# EAGLE board RX08-3-5-9 (EAGLE 6.6.0), part 1 of 2
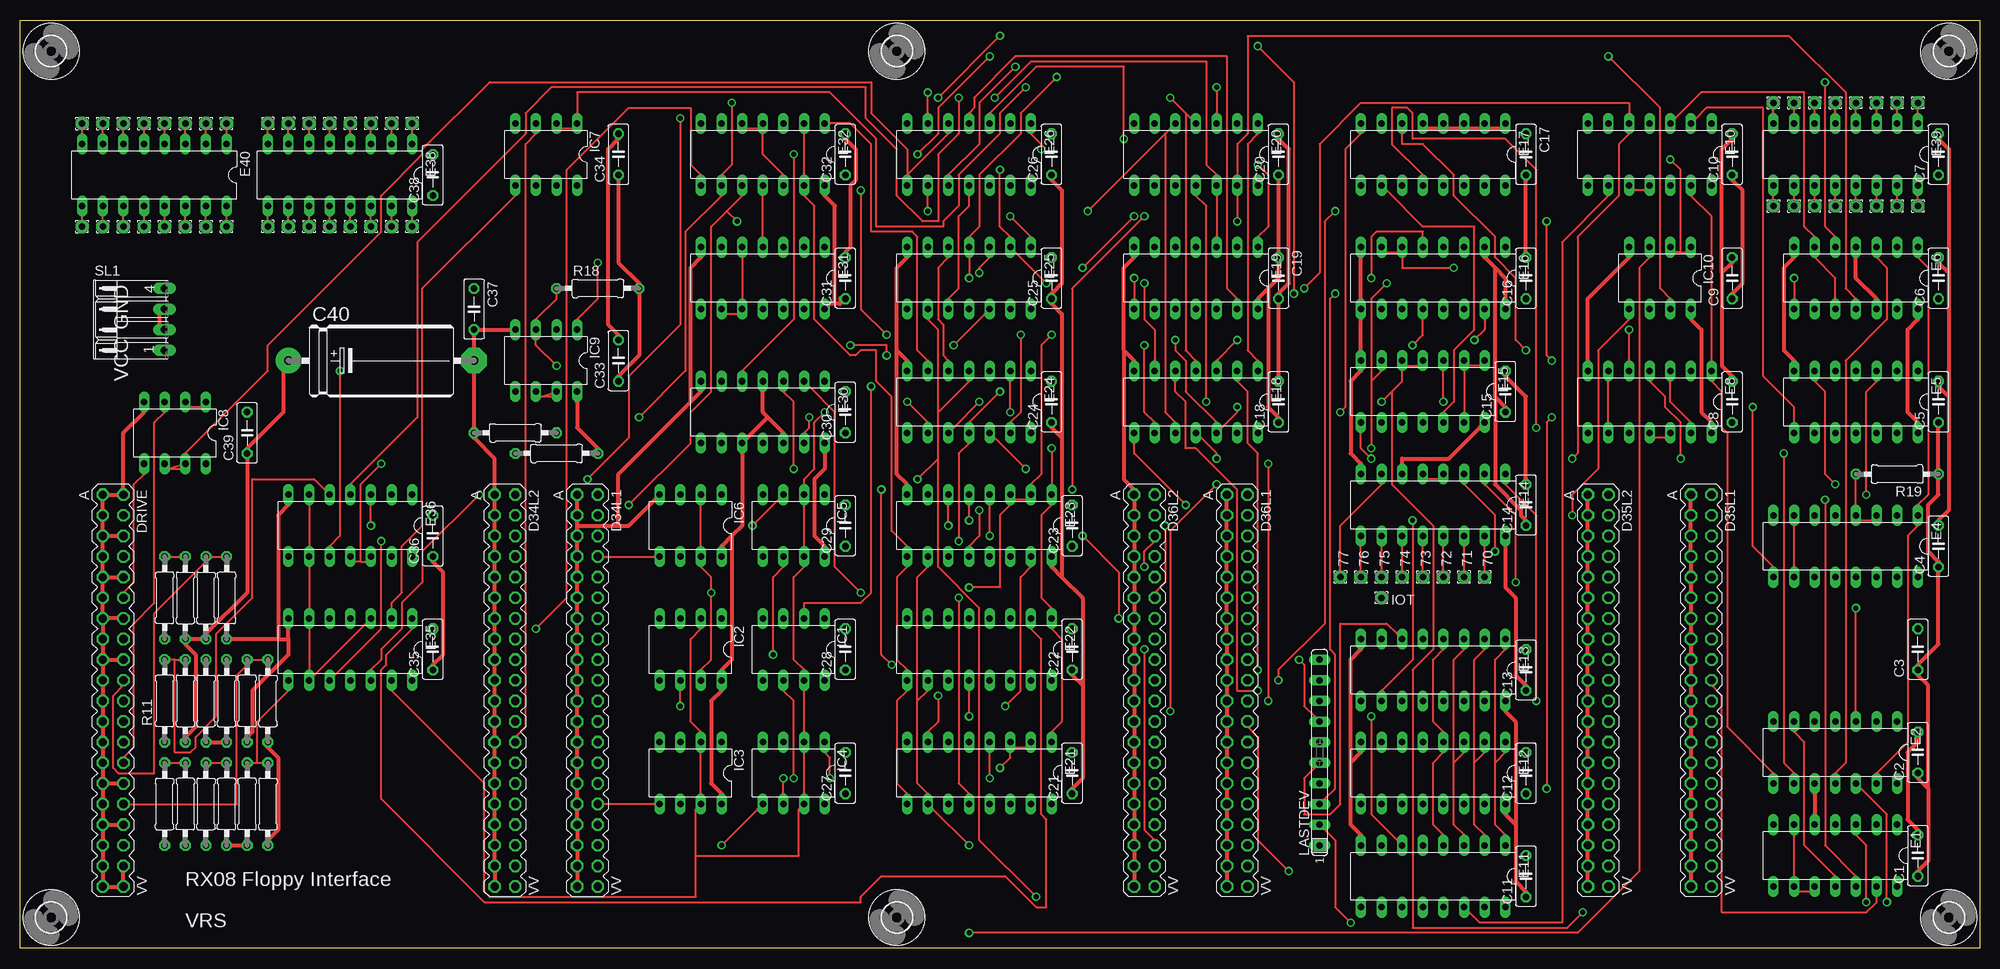
[diagram p3: board, top side]
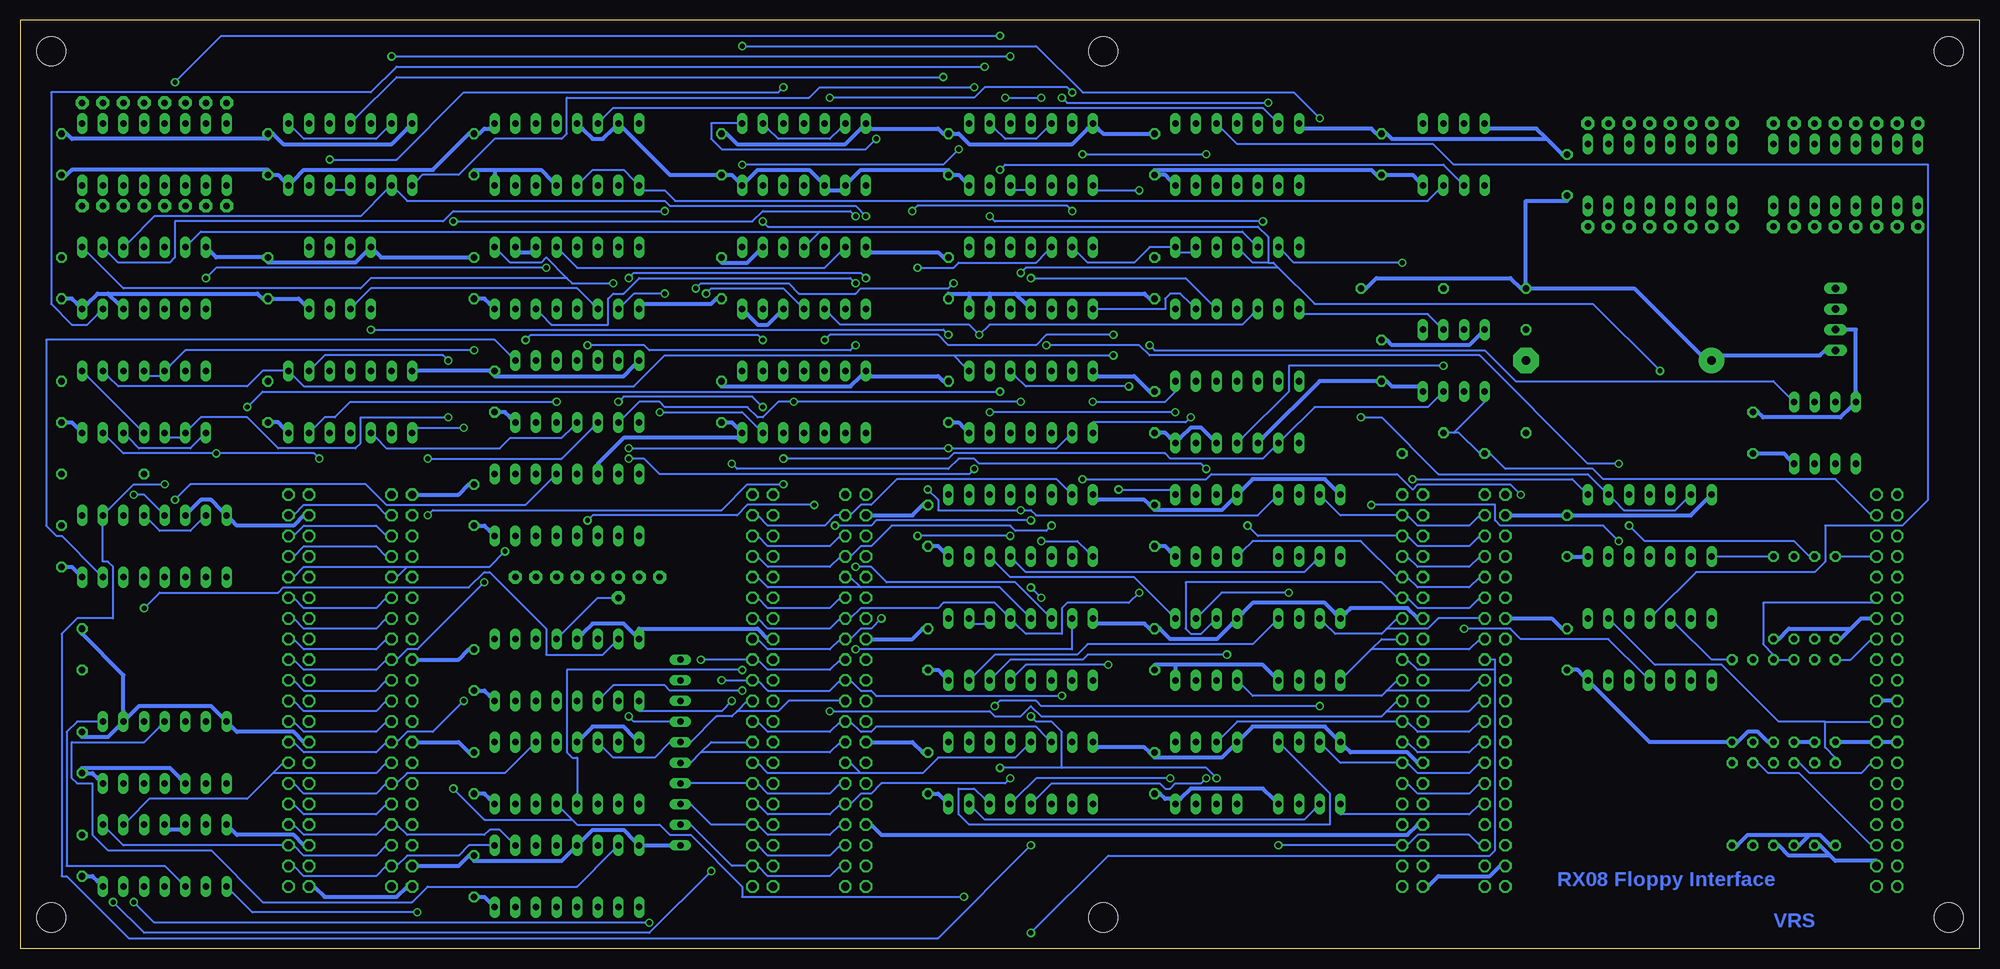
[diagram p4: board, bottom side, seen from below]

Size 241.3 x 114.3 mm. Coordinates in mm from the lower left corner, seen from the top.
Outline: 0,0 0,114.3 241.3,114.3 241.3,0 0,0
Copper layers (1*16): Top 0.035mm / dielectric 1.5mm / Bottom 0.035mm
Design rules "olimex10mil": minimum track width 10mil, minimum drill 24mil, track to track 10mil, track to pad 10mil, pad to pad 10mil, via to via 10mil, smd to smd 10mil, copper to edge 25mil, drill to drill 10mil, minimum pad ring 10mil, minimum via ring 8mil, stop-mask expansion 0mil, vias tented up to drill 0mil, thermal gap 10mil
Net classes: 1 supply: width 0.508 mm

## Footprints (pad centres in the part's own frame; a part is rotated, then mirrored left to right if it is on the bottom)
1,6/0,8 = drill 0.813 pad 1.6 octagon: 1 0,0
C050-025X075 = drill 0.813 octagon: 1 -2.54,0; 2 2.54,0
E22-9 = drill 1.016 pad 3.15: + -11.43,0 | drill 1.016 pad 3.15 octagon: - 11.43,0
DEC40PINV = drill 1.016 octagon: A -24.13,-1.27; AA 3.81,-1.27; B -24.13,1.27; BB 3.81,1.27; C -21.59,-1.27; CC 6.35,-1.27; D -21.59,1.27; DD 6.35,1.27; E -19.05,-1.27; EE 8.89,-1.27; F -19.05,1.27; FF 8.89,1.27; H -16.51,-1.27; HH 11.43,-1.27; J -16.51,1.27; JJ 11.43,1.27; K -13.97,-1.27; KK 13.97,-1.27; L -13.97,1.27; LL 13.97,1.27; M -11.43,-1.27; MM 16.51,-1.27; N -11.43,1.27; NN 16.51,1.27; P -8.89,-1.27; PP 19.05,-1.27; R -8.89,1.27; RR 19.05,1.27; S -6.35,-1.27; SS 21.59,-1.27; T -6.35,1.27; TT 21.59,1.27; U -3.81,-1.27; UU 24.13,-1.27; V -3.81,1.27; VV 24.13,1.27; W -1.27,-1.27; X -1.27,1.27; Y 1.27,-1.27; Z 1.27,1.27
DIL14 = drill 0.813 long: 1 -7.62,-3.81; 2 -5.08,-3.81; 3 -2.54,-3.81; 4 0,-3.81; 5 2.54,-3.81; 6 5.08,-3.81; 7 7.62,-3.81; 8 7.62,3.81; 9 5.08,3.81; 10 2.54,3.81; 11 0,3.81; 12 -2.54,3.81; 13 -5.08,3.81; 14 -7.62,3.81
DIL16 = drill 0.813 long: 1 -8.89,-3.81; 2 -6.35,-3.81; 3 -3.81,-3.81; 4 -1.27,-3.81; 5 1.27,-3.81; 6 3.81,-3.81; 7 6.35,-3.81; 8 8.89,-3.81; 9 8.89,3.81; 10 6.35,3.81; 11 3.81,3.81; 12 1.27,3.81; 13 -1.27,3.81; 14 -3.81,3.81; 15 -6.35,3.81; 16 -8.89,3.81
DIL08 = drill 0.813 long: 1 -3.81,-3.81; 2 -1.27,-3.81; 3 1.27,-3.81; 4 3.81,-3.81; 5 3.81,3.81; 6 1.27,3.81; 7 -1.27,3.81; 8 -3.81,3.81
SIL10 = drill 0.813 long: 1 -11.43,0; 2 -8.89,0; 3 -6.35,0; 4 -3.81,0; 5 -1.27,0; 6 1.27,0; 7 3.81,0; 8 6.35,0; 9 8.89,0; 10 11.43,0
0207/10 = drill 0.813 octagon: 1 -5.08,0; 2 5.08,0
04PA = drill 0.914 long: 1 -3.81,0; 2 -1.27,0; 3 1.27,0; 4 3.81,0
3,6 = hole 3.6: 0,0

## Placement (x,y rotation side)
70  [1,6/0,8]  180.34,45.72 270 top
71  [1,6/0,8]  177.8,45.72 270 top
72  [1,6/0,8]  175.26,45.72 270 top
73  [1,6/0,8]  172.72,45.72 270 top
74  [1,6/0,8]  170.18,45.72 270 top
75  [1,6/0,8]  167.64,45.72 270 top
76  [1,6/0,8]  165.1,45.72 270 top
77  [1,6/0,8]  162.56,45.72 270 top
C1  0.1  [C050-025X075]  233.68,11.43 90 top
C2  0.1  [C050-025X075]  233.68,24.13 90 top
C3  0.1  [C050-025X075]  233.68,36.83 90 top
C4  0.1  [C050-025X075]  236.22,49.53 90 top
C5  0.1  [C050-025X075]  236.22,67.31 90 top
C6  0.1  [C050-025X075]  236.22,82.55 90 top
C7  0.1  [C050-025X075]  236.22,97.79 90 top
C8  0.1  [C050-025X075]  210.82,67.31 90 top
C9  0.1  [C050-025X075]  210.82,82.55 90 top
C10  0.1  [C050-025X075]  210.82,97.79 90 top
C11  0.1  [C050-025X075]  185.42,8.89 90 top
C12  0.1  [C050-025X075]  185.42,21.59 90 top
C13  0.1  [C050-025X075]  185.42,34.29 90 top
C14  0.1  [C050-025X075]  185.42,54.61 90 top
C15  0.1  [C050-025X075]  182.88,68.58 90 top
C16  0.1  [C050-025X075]  185.42,82.55 90 top
C17  0.1  [C050-025X075]  185.42,97.79 270 top
C18  0.1  [C050-025X075]  154.94,67.31 90 top
C19  0.1  [C050-025X075]  154.94,82.55 270 top
C20  0.1  [C050-025X075]  154.94,97.79 90 top
C21  0.1  [C050-025X075]  129.54,21.59 90 top
C22  0.1  [C050-025X075]  129.54,36.83 90 top
C23  0.1  [C050-025X075]  129.54,52.07 90 top
C24  0.1  [C050-025X075]  127,67.31 90 top
C25  0.1  [C050-025X075]  127,82.55 90 top
C26  0.1  [C050-025X075]  127,97.79 90 top
C27  0.1  [C050-025X075]  101.6,21.59 90 top
C28  0.1  [C050-025X075]  101.6,36.83 90 top
C29  0.1  [C050-025X075]  101.6,52.07 90 top
C30  0.1  [C050-025X075]  101.6,66.04 90 top
C31  0.1  [C050-025X075]  101.6,82.55 90 top
C32  0.1  [C050-025X075]  101.6,97.79 90 top
C33  0.1  [C050-025X075]  73.66,72.39 90 top
C34  0.1  [C050-025X075]  73.66,97.79 90 top
C35  0.1  [C050-025X075]  50.8,36.83 90 top
C36  0.1  [C050-025X075]  50.8,50.8 90 top
C37  0.1  [C050-025X075]  55.88,78.74 270 top
C38  0.1  [C050-025X075]  50.8,95.25 90 top
C39  0.1  [C050-025X075]  27.94,63.5 90 top
C40  100uf  [E22-9]  44.45,72.39 0 top
D34L1  [DEC40PINV]  69.85,31.75 270 top
D34L2  [DEC40PINV]  59.69,31.75 270 top
D35L1  [DEC40PINV]  207.01,31.75 270 top
D35L2  [DEC40PINV]  194.31,31.75 270 top
D36L1  [DEC40PINV]  149.86,31.75 270 top
D36L2  [DEC40PINV]  138.43,31.75 270 top
DRIVE  [DEC40PINV]  11.43,31.75 270 top
E1  74LS10N  [DIL14]  223.52,11.43 180 top
E2  74LS74N  [DIL14]  223.52,24.13 180 top
E4  74LS161N  [DIL16]  224.79,49.53 180 top
E5  74LS00N  [DIL14]  226.06,67.31 180 top
E6  74LS74N  [DIL14]  226.06,82.55 180 top
E8  74LS10N  [DIL14]  200.66,67.31 180 top
E10  74LS10N  [DIL14]  200.66,97.79 180 top
E11  74LS138N  [DIL16]  173.99,8.89 180 top
E12  74LS138N  [DIL16]  173.99,21.59 180 top
E13  74LS138N  [DIL16]  173.99,34.29 180 top
E14  74LS138N  [DIL16]  173.99,54.61 180 top
E15  74LS00N  [DIL14]  172.72,68.58 180 top
E16  74LS195N  [DIL16]  173.99,82.55 180 top
E17  7476N  [DIL16]  173.99,97.79 180 top
E18  74LS02N  [DIL14]  144.78,67.31 180 top
E19  74LS74N  [DIL14]  144.78,82.55 180 top
E20  74LS32N  [DIL14]  144.78,97.79 180 top
E21  74LS195N  [DIL16]  118.11,21.59 180 top
E22  74LS195N  [DIL16]  118.11,36.83 180 top
E23  74LS195N  [DIL16]  118.11,52.07 180 top
E24  74LS08N  [DIL14]  116.84,67.31 180 top
E25  74LS04N  [DIL14]  116.84,82.55 180 top
E26  74LS02N  [DIL14]  116.84,97.79 180 top
E30  74LS74N  [DIL14]  91.44,66.04 180 top
E31  74LS20N  [DIL14]  91.44,82.55 180 top
E32  74LS27N  [DIL14]  91.44,97.79 180 top
E35  74LS02N  [DIL14]  40.64,36.83 180 top
E36  74LS02N  [DIL14]  40.64,52.07 180 top
E38  SPARE  [DIL16]  39.37,95.25 180 top
E39  SPARE  [DIL16]  224.79,97.79 180 top
E40  SPARE  [DIL16]  16.51,95.25 180 top
IC1  DS75452N  [DIL08]  95.25,36.83 180 top
IC2  DS75452N  [DIL08]  82.55,36.83 180 top
IC3  DS75452N  [DIL08]  82.55,21.59 180 top
IC4  DS75452N  [DIL08]  95.25,21.59 180 top
IC5  DS75452N  [DIL08]  95.25,52.07 180 top
IC6  DS75452N  [DIL08]  82.55,52.07 180 top
IC7  DS75452N  [DIL08]  64.77,97.79 180 top
IC8  DS75452N  [DIL08]  19.05,63.5 180 top
IC9  DS75452N  [DIL08]  64.77,72.39 180 top
IC10  DS75452N  [DIL08]  201.93,82.55 180 top
IOT  [1,6/0,8]  167.64,43.18 270 top
LASTDEV  100  [SIL10]  160.02,24.13 90 top
PAD10  [1,6/0,8]  48.26,101.6 0 top
PAD11  [1,6/0,8]  45.72,101.6 0 top
PAD12  [1,6/0,8]  43.18,101.6 0 top
PAD13  [1,6/0,8]  40.64,101.6 0 top
PAD14  [1,6/0,8]  38.1,101.6 0 top
PAD15  [1,6/0,8]  35.56,101.6 0 top
PAD16  [1,6/0,8]  33.02,101.6 0 top
PAD17  [1,6/0,8]  30.48,101.6 0 top
PAD18  [1,6/0,8]  25.4,101.6 180 top
PAD19  [1,6/0,8]  22.86,101.6 180 top
PAD20  [1,6/0,8]  48.26,88.9 0 top
PAD21  [1,6/0,8]  45.72,88.9 0 top
PAD22  [1,6/0,8]  43.18,88.9 0 top
PAD23  [1,6/0,8]  40.64,88.9 0 top
PAD24  [1,6/0,8]  38.1,88.9 0 top
PAD25  [1,6/0,8]  35.56,88.9 0 top
PAD26  [1,6/0,8]  33.02,88.9 0 top
PAD27  [1,6/0,8]  30.48,88.9 0 top
PAD28  [1,6/0,8]  20.32,101.6 180 top
PAD29  [1,6/0,8]  17.78,101.6 180 top
PAD30  [1,6/0,8]  15.24,101.6 180 top
PAD31  [1,6/0,8]  12.7,101.6 180 top
PAD32  [1,6/0,8]  10.16,101.6 180 top
PAD33  [1,6/0,8]  7.62,101.6 180 top
PAD34  [1,6/0,8]  25.4,88.9 180 top
PAD35  [1,6/0,8]  22.86,88.9 180 top
PAD36  [1,6/0,8]  20.32,88.9 180 top
PAD37  [1,6/0,8]  17.78,88.9 180 top
PAD38  [1,6/0,8]  15.24,88.9 180 top
PAD39  [1,6/0,8]  12.7,88.9 180 top
PAD40  [1,6/0,8]  10.16,88.9 180 top
PAD41  [1,6/0,8]  7.62,88.9 180 top
PAD42  [1,6/0,8]  233.68,104.14 180 top
PAD43  [1,6/0,8]  231.14,104.14 180 top
PAD44  [1,6/0,8]  228.6,104.14 180 top
PAD45  [1,6/0,8]  226.06,104.14 180 top
PAD46  [1,6/0,8]  223.52,104.14 180 top
PAD47  [1,6/0,8]  220.98,104.14 180 top
PAD48  [1,6/0,8]  218.44,104.14 180 top
PAD49  [1,6/0,8]  215.9,104.14 180 top
PAD50  [1,6/0,8]  233.68,91.44 180 top
PAD51  [1,6/0,8]  231.14,91.44 180 top
PAD52  [1,6/0,8]  228.6,91.44 180 top
PAD53  [1,6/0,8]  226.06,91.44 180 top
PAD54  [1,6/0,8]  223.52,91.44 180 top
PAD55  [1,6/0,8]  220.98,91.44 180 top
PAD56  [1,6/0,8]  218.44,91.44 180 top
PAD57  [1,6/0,8]  215.9,91.44 180 top
R1  180  [0207/10]  20.32,30.48 270 top
R2  180  [0207/10]  30.48,30.48 270 top
R3  180  [0207/10]  30.48,17.78 270 top
R4  180  [0207/10]  22.86,43.18 270 top
R5  180  [0207/10]  20.32,43.18 270 top
R6  180  [0207/10]  66.04,60.96 0 top
R7  180  [0207/10]  22.86,17.78 270 top
R8  180  [0207/10]  17.78,17.78 270 top
R9  390  [0207/10]  22.86,30.48 270 top
R10  390  [0207/10]  27.94,30.48 90 top
R11  390  [0207/10]  17.78,30.48 90 top
R12  390  [0207/10]  27.94,17.78 90 top
R13  390  [0207/10]  25.4,43.18 90 top
R14  390  [0207/10]  17.78,43.18 90 top
R15  390  [0207/10]  60.96,63.5 0 top
R16  390  [0207/10]  25.4,17.78 90 top
R17  390  [0207/10]  20.32,17.78 90 top
R18  10K  [0207/10]  71.12,81.28 0 top
R19  10K  [0207/10]  231.14,58.42 180 top
R20  180  [0207/10]  25.4,30.48 270 top
SL1  [04PA]  17.78,77.47 90 top
U$1  [3,6]  237.49,3.81 0 top
U$2  [3,6]  237.49,110.49 0 top
U$3  [3,6]  3.81,110.49 0 top
U$4  [3,6]  3.81,3.81 0 top
U$5  [3,6]  107.95,110.49 0 top
U$6  [3,6]  107.95,3.81 0 top

## Tracks (layer width: path | path; a pad name or v marks a point on that pad's centre or on a via)
8/12  (via drill 0.61)
  Top 0.254: v204.47,60.33 204.47,64.77 202.56,66.67 202.56,67.94 200.66,69.85 E8.4 | v217.17,60.96 217.17,22.86 218.44,21.59 E2.9
  Bottom 0.254: v204.47,60.33 205.1,60.96 v217.17,60.96 228.6,60.96 230.5,62.87 E5.13
8/!12  (via drill 0.61)
  Top 0.254: IC8.2 20.95,66.67 22.23,66.67 IC8.1 | E2.8 215.9,21.59 210.19,27.3 210.19,63.5 209.55,64.14 209.55,68.58 208.28,69.85 E8.1 208.28,72.39 208.28,90.17 205.74,92.71 E10.13 | v102.23,74.3 106.68,74.3 v106.68,73.03
  Bottom 0.254: 126.36,73.03 125.09,71.75 E24.1 | 126.36,73.03 161.93,73.03 165.74,69.22 206.38,69.22 207.65,70.48 E8.1 208.91,71.12 211.46,71.12 213.36,69.22 229.24,69.22 230.5,70.48 E5.2 | v102.23,74.3 101.6,73.66 60.96,73.66 57.15,69.85 25.4,69.85 23.5,67.94 IC8.1 | 126.36,73.03 v106.68,73.03
!ACB00
  Bottom 0.254: IC6.3 80.64,55.24 78.74,53.34 71.75,53.34 D34L1.D 70.48,53.34 69.22,52.07 62.87,52.07 61.59,53.34 D34L2.D
!ACB01
  Top 0.254: IC6.5 78.11,48.26 71.75,48.26 D34L1.J
  Bottom 0.254: D34L2.J 61.59,48.26 62.87,46.99 69.22,46.99 70.48,48.26 D34L1.J
!ACB02
  Bottom 0.254: IC1.3 94.61,40.01 95.89,38.73 97.16,38.73 97.79,39.37 97.79,45.09 73.66,45.09 71.75,43.18 D34L1.N 70.48,43.18 69.22,41.91 62.87,41.91 61.59,43.18 D34L2.N
!ACB03
  Bottom 0.254: 74.93,36.83 73.66,38.1 71.75,38.1 D34L1.T | 74.93,36.83 78.11,33.66 IC2.5 | 74.93,36.83 62.87,36.83 61.59,38.1 D34L2.T
!ACB04
  Bottom 0.254: 73.03,31.75 71.75,33.02 D34L1.X | 73.03,31.75 73.66,31.11 89.53,31.11 90.81,32.38 IC1.5 | 73.03,31.75 62.87,31.75 61.59,33.02 D34L2.X
!ACB05
  Bottom 0.254: IC4.3 93.34,26.04 91.44,27.94 71.75,27.94 D34L1.BB 70.48,27.94 69.22,26.67 62.87,26.67 61.59,27.94 D34L2.BB
!ACB06
  Bottom 0.254: IC3.3 80.64,24.77 78.74,22.86 71.75,22.86 D34L1.FF 70.48,22.86 69.22,21.59 62.87,21.59 61.59,22.86 D34L2.FF
!ACB07
  Top 0.254: IC3.5 78.11,17.78 71.75,17.78 D34L1.LL
  Bottom 0.254: D34L2.LL 61.59,17.78 62.87,16.51 78.74,16.51 IC3.5
!ACB08  (via drill 0.61)
  Top 0.254: v86.36,12.7 90.81,17.14 IC4.5
  Bottom 0.254: v86.36,12.7 71.75,12.7 D34L1.RR 70.48,12.7 69.22,13.97 62.87,13.97 61.59,12.7 D34L2.RR
!ACB09  (via drill 0.61)
  Top 0.254: v90.17,52.07 93.34,55.24 IC5.3
  Bottom 0.254: v90.17,52.07 88.9,50.8 71.75,50.8 D34L1.F 70.48,50.8 69.22,49.53 62.87,49.53 61.59,50.8 D34L2.F
!ACB10
  Bottom 0.254: IC5.5 90.81,48.9 89.53,50.16 76.2,50.16 71.75,45.72 D34L1.L 70.48,45.72 69.22,44.45 62.87,44.45 61.59,45.72 D34L2.L
!ACB11
  Bottom 0.254: 73.03,39.37 71.75,40.64 D34L1.R | 73.03,39.37 73.66,38.73 79.38,38.73 80.64,40.01 IC2.3 | 73.03,39.37 67.94,39.37 66.67,40.64 61.59,40.64 D34L2.R
!ACCLEAR
  Top 0.254: IC7.3 63.5,100.33 62.23,99.06 62.23,27.3 60.96,26.04 D34L2.DD
  Bottom 0.254: D34L1.DD 70.48,25.4 69.22,24.13 62.87,24.13 61.59,25.4 D34L2.DD
!BMB03
  Bottom 0.254: D35L2.T 196.22,38.1 197.49,36.83 206.38,36.83 207.65,38.1 D35L1.T
!BMB04
  Bottom 0.254: D35L2.BB 196.22,27.94 197.49,26.67 206.38,26.67 207.65,27.94 D35L1.BB
!BMB05
  Bottom 0.254: D35L2.LL 196.22,17.78 197.49,16.51 206.38,16.51 207.65,17.78 D35L1.LL
!BMB06
  Bottom 0.254: D35L2.F 196.22,50.8 197.49,52.07 206.38,52.07 207.65,50.8 D35L1.F
!BMB07
  Bottom 0.254: D35L2.R 196.22,40.64 197.49,39.37 206.38,39.37 207.65,40.64 D35L1.R
!BMB08
  Bottom 0.254: D35L2.Z 196.22,30.48 197.49,29.21 206.38,29.21 207.65,30.48 D35L1.Z
!BRUN
  Bottom 0.254: D34L2.JJ 61.59,20.32 62.87,19.05 69.22,19.05 70.48,20.32 D34L1.JJ
!CLK_PARITY  (via drill 0.61)
  Top 0.254: v185.42,73.66 184.15,74.93 184.15,82.55 181.61,85.09 181.61,87.63 176.53,92.71 176.53,95.25 172.72,99.06 170.18,99.06 170.18,100.33 E17.6
  Bottom 0.254: E5.4 225.43,70.48 224.16,70.48 E5.5 222.88,71.75 220.98,73.66 v185.42,73.66 | E32.6 87,102.23 88.27,103.5 168.28,103.5 169.54,102.23 E17.6
!DONE  (via drill 0.61)
  Top 0.254: v116.84,82.55 116.84,85.09 E25.4 116.84,87.63 118.11,88.9 118.11,95.25 123.19,100.33 123.19,102.87 v127.64,107.31
  Bottom 0.254: v116.84,82.55 97.79,82.55 94.61,79.38 E31.12 | v127.64,107.31 194.94,107.31 200.03,102.23 E10.4
!DONE_FF  (via drill 0.61)
  Top 0.254: v138.43,74.3 138.43,66.04 139.7,64.77 E18.9 | v171.45,74.3 172.72,75.56 172.72,77.47 E16.12
  Bottom 0.254: v138.43,74.3 139.06,73.66 163.83,73.66 164.47,74.3 v171.45,74.3
!ENB_BUF_LD  (via drill 0.61)
  Top 0.254: E32.2 96.52,100.33 96.52,95.25 E32.13 96.52,92.71 97.79,91.44 97.79,77.47 102.23,73.03 102.87,73.03 103.5,73.66 105.41,73.66 105.41,69.85 107.31,67.94 107.31,51.44 109.22,49.53 E23.9 109.22,46.99 107.95,45.72 107.95,35.56 109.22,34.29 E22.9 109.22,31.75 107.95,30.48 107.95,20.32 109.22,19.05 E21.9 | v213.36,66.67 213.36,49.53 215.9,46.99 E4.9 | v120.65,68.58 116.84,64.77 E24.11 116.84,62.23 115.57,60.96 v115.57,50.16
  Bottom 0.254: v213.36,66.67 211.46,68.58 v120.65,68.58 | v115.57,50.16 111.12,50.16 109.86,48.9 E23.9
!ERR_FF  (via drill 0.61)
  Top 0.254: v138.43,81.92 138.43,77.47 139.7,76.2 139.7,72.39 E18.6
  Bottom 0.254: v138.43,81.92 139.06,82.55 165.1,82.55 167,80.64 168.28,80.64 168.91,80.01 168.91,76.83 175.9,76.83 177.16,78.11 E16.14
!INIT  (via drill 0.61)
  Top 0.254: E2.13 228.6,21.59 232.41,25.4 232.41,50.8 233.68,52.07 E4.1 233.68,54.61 234.95,55.88 234.95,83.82 233.68,85.09 E6.1 | E21.1 127,26.67 128.27,27.94 128.27,38.1 127,39.37 E22.1 127,41.91 125.73,43.18 125.73,53.34 127,54.61 E23.1 127,57.15 v127,61.59 | v109.22,67.31 111.76,64.77 E24.9 | 166.37,69.85 167.64,71.12 E15.6 | 166.37,69.85 v166.37,61.59 | v168.28,81.92 166.37,80.01 166.37,69.85
  Bottom 0.254: E24.9 112.39,62.87 113.67,61.59 v127,61.59 v166.37,61.59 | v109.22,67.31 100.33,67.31 99.06,68.58 E30.1 | 173.99,82.55 173.35,81.92 v168.28,81.92 | 173.99,82.55 176.53,85.09 177.16,84.45 180.97,84.45 182.25,85.72 E16.1 | 173.99,82.55 198.12,82.55 199.39,81.28 228.6,81.28 233.04,85.72 E6.1
!INIT1
  Bottom 0.254: E11.7 168.28,12.06 172.72,7.62 191.13,7.62 193.04,5.71 211.46,5.71 217.81,12.06 230.5,12.06 232.41,13.97 232.41,20.32 234.31,20.32 234.95,20.95 234.95,25.4 226.06,25.4 224.16,27.3 E2.4
!INIT4  (via drill 0.61)
  Top 0.254: v226.06,41.91 226.06,29.21 E2.3
  Bottom 0.254: v226.06,41.91 224.16,43.81 209.55,43.81 208.91,44.45 186.06,44.45 184.15,46.35 183.51,46.35 176.53,39.37 176.53,36.2 169.54,36.2 168.28,37.47 E13.7
!INT_RQ  (via drill 0.61)
  Top 0.254: v191.13,53.34 191.13,55.88 194.31,59.05 194.31,73.66 198.12,77.47 IC10.5 | v147.32,57.15 141.6,51.44 v141.6,29.21
  Bottom 0.254: v191.13,53.34 190.5,53.98 154.94,53.98 151.76,57.15 v147.32,57.15 | v141.6,29.21 121.92,29.21 121.28,28.57 118.11,28.57 116.84,29.84 115.57,28.57 73.66,28.57 73.03,29.21 | 73.03,29.21 71.75,30.48 D34L1.Z | 73.03,29.21 62.87,29.21 61.59,30.48 D34L2.Z
!INTR4  (via drill 0.61)
  Top 0.254: v95.25,59.05 95.25,67.31 93.98,68.58 E30.3 | v153.67,59.69 v153.67,30.48
  Bottom 0.254: v95.25,59.05 95.89,59.69 123.19,59.69 123.83,60.33 125.73,60.33 127,59.05 153.03,59.05 v153.67,59.69 | v153.67,30.48 154.94,29.21 165.1,29.21 E13.9
!IOS  (via drill 0.61)
  Top 0.254: v116.84,1.91 191.77,1.91 199.39,9.53 199.39,83.82 200.66,85.09 IC10.3
  Bottom 0.254: v116.84,1.91 107.31,11.43 60.33,11.43 59.69,12.06 59.69,34.29 | 59.69,34.29 59.69,35.56 60.33,35.56 D34L2.V | 59.69,34.29 69.22,34.29 70.48,35.56 D34L1.V
!LCD1  (via drill 0.61)
  Top 0.254: E2.11 223.52,21.59 224.79,22.86 224.79,72.39 229.87,77.47 229.87,83.82 228.6,85.09 E6.3 | E24.5 114.3,72.39 113.67,73.03 113.67,76.83 113.03,77.47 113.03,83.82 114.3,85.09 E25.5 | E11.14 178.44,4.45 179.71,3.17 189.87,3.17 189.87,87 195.58,92.71 E10.9 | v137.16,90.17 v130.81,83.82
  Bottom 0.254: v130.81,83.82 126.36,83.82 125.73,84.45 116.2,84.45 114.94,85.72 E25.5 | v137.16,90.17 138.43,91.44 161.29,91.44 161.93,92.08 193.68,92.08 194.94,93.34 E10.9 196.22,93.34 199.39,90.17 224.79,90.17 227.97,87 E6.3
!MAINT  (via drill 0.61)
  Top 0.254: E6.10 223.52,80.01 223.52,82.55 220.98,85.09 E6.6 220.98,87.63 219.71,88.9 219.71,105.41 207.01,105.41 203.84,102.23 E10.3 | v123.19,75.56 123.19,66.04 121.92,64.77 E24.13 | E31.9 87,78.11 88.27,78.11 E31.10 88.9,80.01 88.9,85.09 E31.5
  Bottom 0.254: E19.10 141.6,78.11 140.34,76.83 124.46,76.83 v123.19,75.56 121.92,76.83 90.81,76.83 89.53,78.11 E31.10 | 142.88,88.27 144.15,87 E19.4 | 142.88,88.27 90.81,88.27 89.53,87 E31.5 | 142.88,88.27 219.07,88.27 220.34,87 E6.6
!MYDEV
  Top 0.254: E11.4 175.26,13.97 173.99,15.24 173.99,22.86 175.26,24.13 E12.4 175.26,26.67 173.99,27.94 173.99,35.56 175.26,36.83 E13.4
  Bottom 0.254: E13.4 174.62,38.73 170.18,43.18 168.28,43.18 IOT.1
!PARITY
  Top 0.254: E17.10 168.28,93.34 172.72,88.9 179.07,88.9 179.07,76.2 176.53,73.66 176.53,67.31 175.26,66.04 E15.12
!RX_12_BIT
  Top 0.254: R7.1 23.5,22.86 24.77,22.86 R16.2 | IC8.3 17.78,66.04 16.51,64.77 16.51,42.55 13.97,40.01 13.97,24.77 12.7,23.5 DRIVE.FF
  Bottom 0.254: R7.1 22.23,22.86 20.95,21.59 14.61,21.59 13.34,22.86 DRIVE.FF
!RX_DATA
  Top 0.254: R8.1 18.41,22.86 19.68,22.86 R17.2 | IC7.5 60.96,92.71 49.53,81.28 49.53,52.07 46.99,49.53 46.99,43.81 45.72,42.55 45.72,41.91 E35.2
  Bottom 0.254: 19.05,27.94 13.34,27.94 DRIVE.BB | 19.05,27.94 24.77,27.94 31.75,34.92 40.01,34.92 45.09,40.01 E35.2 | 19.05,27.94 19.05,24.77 17.78,23.5 R8.1
!RX_DONE
  Top 0.254: R13.2 24.77,48.26 23.5,48.26 R4.1 22.86,47.62 16.51,41.27 16.51,21.59 12.06,21.59 11.43,22.23 11.43,31.11 12.7,32.38 DRIVE.X
  Bottom 0.254: E36.8 32.38,48.26 26.04,48.26 R13.2
!RX_ERROR  (via drill 0.61)
  Top 0.254: R14.2 18.41,48.26 19.68,48.26 R5.1 | v43.18,52.07 43.18,54.61 E36.3
  Bottom 0.254: v43.18,52.07 41.27,50.16 22.86,50.16 20.95,48.26 R5.1 | DRIVE.J 13.34,48.26 17.14,48.26 R14.2
!RX_INIT
  Top 0.254: IC8.5 15.24,58.42 13.97,57.15 13.97,45.09 12.7,43.81 DRIVE.N
  Bottom 0.254: R9.1 23.5,35.56 24.77,35.56 R20.1 25.4,36.2 26.67,37.47 26.67,42.55 12.7,42.55 DRIVE.N
!RX_OUT
  Top 0.254: 29.21,22.86 29.84,22.86 R3.1 | 29.21,22.86 28.57,22.86 R12.2 | 29.21,22.86 29.21,27.94 33.02,31.75 E35.8
  Bottom 0.254: DRIVE.RR 13.34,12.7 22.23,21.59 26.04,21.59 27.3,22.86 R12.2
!RX_RUN
  Bottom 0.254: 64.77,63.5 65.41,63.5 R15.2 | 64.77,63.5 64.14,63.5 61.59,60.96 R6.1 60.33,60.96 58.42,59.05 47.62,59.05 46.35,57.78 17.78,57.78 13.34,53.34 DRIVE.D | 64.77,63.5 60.96,67.31 IC9.5
!RX_SHIFT
  Top 0.254: R2.1 29.84,35.56 28.57,35.56 R10.2 27.94,34.92 26.67,33.66 26.67,17.78 13.34,17.78 DRIVE.LL
  Bottom 0.254: E35.5 37.47,40.01 33.02,35.56 31.11,35.56 R2.1
!RX_TR_REQ
  Top 0.254: 19.05,35.56 19.68,35.56 R1.1 | 19.05,35.56 18.41,35.56 R11.2 | 19.05,35.56 19.05,24.13 20.95,24.13 21.59,24.77 21.59,26.04 24.13,28.57 24.13,38.73 28.57,43.18 28.57,57.78 36.2,57.78 37.47,56.52 E36.5
  Bottom 0.254: DRIVE.T 13.34,38.1 15.88,35.56 17.14,35.56 R11.2
!SDN4  (via drill 0.61)
  Top 0.254: v171.45,52.7 171.45,35.56 167.64,31.75 E13.10 | v143.51,54.61 137.16,60.96 137.16,62.23 E18.8
  Bottom 0.254: v171.45,52.7 170.81,53.34 153.03,53.34 151.76,54.61 v143.51,54.61
!SER4  (via drill 0.61)
  Top 0.254: v152.4,31.75 149.86,31.75 149.86,56.52 144.78,61.59 143.51,61.59 143.51,67.31 142.24,68.58 142.24,69.85 E18.5
  Bottom 0.254: v152.4,31.75 161.29,31.75 161.93,32.38 168.28,32.38 169.54,31.11 E13.11
!STR2  (via drill 0.61)
  Top 0.254: v152.4,34.29 152.4,60.96 151.13,62.23 151.13,68.58 149.86,69.85 E18.2
  Bottom 0.254: v152.4,34.29 173.99,34.29 173.99,24.13 173.35,23.5 172.72,23.5 172.72,19.05 E12.12
!TR_FF  (via drill 0.61)
  Top 0.254: v149.86,74.93 147.32,72.39 E18.3 | v179.07,74.93 180.34,76.2 180.34,77.47 E16.15
  Bottom 0.254: v149.86,74.93 150.5,75.56 178.44,75.56 v179.07,74.93
!XDR2  (via drill 0.61)
  Top 0.254: v56.52,55.88 49.53,48.9 49.53,45.09 46.99,42.55 46.99,39.37 44.45,36.83 44.45,35.56 43.18,34.29 E35.12 | 113.03,60.33 v110.49,57.78 | 113.03,60.33 113.03,66.04 | 113.03,66.04 116.84,69.85 E24.4 | v125.09,6.35 118.11,13.34 118.11,41.91 113.03,46.99 113.03,60.33 | 113.03,66.04 113.03,76.2 111.76,77.47 E25.9 | v188.59,65.41 187.96,64.77 v187.96,19.68
  Bottom 0.254: E5.10 222.88,62.87 221.62,62.87 E5.9 220.34,64.14 219.07,65.41 213.36,65.41 209.55,61.59 200.03,61.59 199.39,62.23 199.39,65.41 v188.59,65.41 | v56.52,55.88 57.78,57.15 69.22,57.15 69.85,56.52 71.75,58.42 94.61,58.42 95.25,57.78 v110.49,57.78 | 173.35,15.88 172.72,15.24 162.56,15.24 161.29,13.97 158.75,13.97 152.4,7.62 152.4,6.35 v125.09,6.35 | 173.35,15.88 174.62,17.14 E12.13 | v187.96,19.68 184.15,15.88 173.35,15.88
BAC00
  Bottom 0.254: E23.7 112.39,56.52 113.67,57.78 133.35,57.78 136.53,54.61 137.79,54.61 139.06,53.34 D36L2.D 140.34,53.34 140.97,53.34 142.24,52.07 149.22,52.07 150.5,53.34 D36L1.D
BAC01  (via drill 0.61)
  Top 0.254: v114.3,52.07 114.3,54.61 E23.6
  Bottom 0.254: v114.3,52.07 114.94,51.44 118.75,51.44 119.38,52.07 133.99,52.07 136.53,49.53 137.79,49.53 139.06,48.26 D36L2.J 140.34,48.26 141.6,46.99 149.22,46.99 150.5,48.26 D36L1.J
BAC02  (via drill 0.61)
  Top 0.254: v116.84,52.7 116.84,54.61 E23.5 | v140.97,52.07 140.97,45.09 139.7,43.81 D36L2.N
  Bottom 0.254: v116.84,52.7 135.89,52.7 136.53,52.07 v140.97,52.07 | D36L1.N 150.5,43.18 149.22,41.91 141.6,41.91 140.34,43.18 D36L2.N
BAC03  (via drill 0.61)
  Top 0.254: v119.38,50.8 119.38,54.61 E23.4 | v130.81,50.8 135.25,46.35 v135.25,40.64
  Bottom 0.254: v119.38,50.8 v130.81,50.8 | v135.25,40.64 136.53,39.37 137.79,39.37 139.06,38.1 D36L2.T 140.34,38.1 141.6,36.83 149.22,36.83 150.5,38.1 D36L1.T
BAC04  (via drill 0.61)
  Top 0.254: v113.03,31.11 113.03,27.94 111.76,26.67 E21.7 | v161.93,90.81 160.66,89.53 160.66,40.01 154.94,34.29 v154.94,33.02
  Bottom 0.254: v113.03,31.11 135.89,31.11 136.53,31.75 137.79,31.75 139.06,33.02 D36L2.X 140.34,33.02 141.6,31.75 149.22,31.75 150.5,33.02 D36L1.X 151.76,33.02 v154.94,33.02 | v161.93,90.81 187.96,90.81 189.23,89.53 222.25,89.53 222.25,85.09 222.88,84.45 229.24,84.45 230.5,85.72 E6.2
BAC05  (via drill 0.61)
  Top 0.254: v229.87,5.71 229.87,16.51 226.69,19.68 E2.12 | v156.21,9.53 152.4,13.34 152.4,26.04 151.13,27.3 D36L1.BB
  Bottom 0.254: E21.6 114.94,26.04 116.2,27.3 135.89,27.3 136.53,26.67 137.79,26.67 139.06,27.94 D36L2.BB 140.34,27.94 141.6,26.67 149.22,26.67 150.5,27.94 D36L1.BB | v229.87,5.71 226.06,1.91 163.83,1.91 v156.21,9.53
BAC06
  Bottom 0.254: 137.79,21.59 130.18,21.59 128.27,23.5 118.75,23.5 117.47,24.77 E21.5 | 137.79,21.59 139.06,22.86 D36L2.FF | 137.79,21.59 149.22,21.59 150.5,22.86 D36L1.FF
BAC07  (via drill 0.61)
  Top 0.254: v119.38,20.95 119.38,24.13 E21.4
  Bottom 0.254: v119.38,20.95 120.02,20.32 135.25,20.32 136.53,19.05 137.79,19.05 139.06,17.78 D36L2.LL 140.34,17.78 141.6,16.51 149.22,16.51 150.5,17.78 D36L1.LL
BAC08  (via drill 0.61)
  Top 0.254: v138.43,36.83 138.43,14.61 139.7,13.34 D36L2.RR
  Bottom 0.254: v138.43,36.83 111.76,36.83 111.76,39.37 E22.7 | D36L1.RR 150.5,12.7 149.22,11.43 141.6,11.43 140.34,12.7 D36L2.RR
BAC09  (via drill 0.61)
  Top 0.254: v138.43,46.99 138.43,48.9 139.7,50.16 D36L2.F
  Bottom 0.254: v138.43,46.99 136.53,46.99 134.62,45.09 118.75,45.09 114.94,41.27 E22.6 | D36L1.F 150.5,50.8 149.22,49.53 141.6,49.53 140.34,50.8 D36L2.F
BAC10
  Bottom 0.254: 137.79,44.45 120.65,44.45 117.47,41.27 E22.5 | 137.79,44.45 139.06,45.72 D36L2.L | 137.79,44.45 149.22,44.45 150.5,45.72 D36L1.L
BAC11  (via drill 0.61)
  Top 0.254: v103.5,43.81 100.33,46.99 100.33,66.04 97.16,69.22 E30.2
  Bottom 0.254: D36L1.R 150.5,40.64 149.22,39.37 141.6,39.37 140.34,40.64 D36L2.R 139.06,40.64 137.79,41.91 128.27,41.91 127.64,42.55 121.28,42.55 120.02,41.27 E22.4 118.75,40.01 117.47,38.73 113.03,38.73 113.03,41.91 112.39,42.55 104.78,42.55 v103.5,43.81
BINIT  (via drill 0.61)
  Top 0.254: v227.33,5.71 227.33,12.7 226.06,13.97 E1.3 | v163.83,3.17 161.93,5.08 161.93,13.34 160.66,14.61 LASTDEV.2
  Bottom 0.254: LASTDEV.2 158.75,15.24 153.67,10.16 151.76,10.16 D36L1.TT 150.5,10.16 149.22,8.89 141.6,8.89 140.34,10.16 D36L2.TT | v227.33,5.71 224.79,3.17 v163.83,3.17
BIOP1  (via drill 0.61)
  Top 0.254: v166.37,28.57 166.37,16.51 169.54,13.34 E11.6 | v157.48,35.56 158.12,34.92 158.12,29.84 159.38,28.57 LASTDEV.7
  Bottom 0.254: D36L2.V 140.34,35.56 141.6,34.29 149.22,34.29 150.5,35.56 D36L1.V 151.76,35.56 v157.48,35.56 | v166.37,28.57 165.74,27.94 161.29,27.94 LASTDEV.7
BIOP2
  Bottom 0.254: 153.03,29.21 151.76,30.48 D36L1.Z | 153.03,29.21 153.67,28.57 155.57,28.57 158.75,25.4 LASTDEV.6 161.29,25.4 163.19,23.5 168.28,23.5 169.54,24.77 E12.6 | 153.03,29.21 147.96,29.21 146.69,30.48 140.34,30.48 D36L2.Z
BIOP4
  Top 0.254: E13.6 169.54,38.73 168.28,40.01 162.56,40.01 162.56,17.78 161.29,16.51 158.12,16.51 158.12,20.95 159.38,22.23 LASTDEV.5
  Bottom 0.254: 157.48,24.13 156.21,25.4 151.76,25.4 D36L1.DD | 157.48,24.13 158.75,22.86 LASTDEV.5 | 157.48,24.13 141.6,24.13 140.34,25.4 D36L2.DD
BMB00
  Bottom 0.254: D35L2.D 196.22,53.34 197.49,54.61 206.38,54.61 207.65,53.34 D35L1.D
BMB01
  Bottom 0.254: D35L2.J 196.22,48.26 197.49,49.53 206.38,49.53 207.65,48.26 D35L1.J
BMB02
  Bottom 0.254: D35L2.N 196.22,43.18 197.49,41.91 206.38,41.91 207.65,43.18 D35L1.N
BMB03
  Top 0.254: E1.13 228.6,6.35 228.6,5.71 227.33,4.45 209.55,4.45 209.55,31.11 208.28,32.38 D35L1.X
  Bottom 0.254: D35L2.X 196.22,33.02 197.49,31.75 206.38,31.75 207.65,33.02 D35L1.X
BMB04
  Bottom 0.254: 210.19,21.59 208.91,22.86 D35L1.FF | 210.19,21.59 213.36,18.41 225.43,18.41 227.97,15.88 E1.2 | 210.19,21.59 197.49,21.59 196.22,22.86 D35L2.FF
BMB05
  Bottom 0.254: E1.1 230.5,14.61 228.6,12.7 208.91,12.7 D35L1.RR 207.65,12.7 206.38,11.43 197.49,11.43 196.22,12.7 D35L2.RR
BMB06  (via drill 0.61)
  Top 0.254: v181.61,48.9 181.61,53.34 177.8,57.15 E14.3
  Bottom 0.254: v181.61,48.9 183.51,46.99 193.68,46.99 | 193.68,46.99 194.94,45.72 D35L2.L | 193.68,46.99 206.38,46.99 207.65,45.72 D35L1.L
BMB07  (via drill 0.61)
  Top 0.254: v184.15,45.09 184.15,53.34 180.34,57.15 E14.2
  Bottom 0.254: v184.15,45.09 192.41,36.83 193.68,36.83 194.94,35.56 D35L2.V 196.22,35.56 197.49,34.29 206.38,34.29 207.65,35.56 D35L1.V
BMB08  (via drill 0.61)
  Top 0.254: v186.69,30.48 186.69,53.34 182.88,57.15 E14.1
  Bottom 0.254: v186.69,30.48 190.5,26.67 193.68,26.67 194.94,25.4 D35L2.DD 196.22,25.4 197.49,24.13 206.38,24.13 207.65,25.4 D35L1.DD
BMB09
  Top 0.254: 176.53,22.86 176.53,15.24 177.8,13.97 E11.3 | 176.53,22.86 177.8,24.13 E12.3 | 176.53,22.86 176.53,35.56 177.8,36.83 E13.3
  Bottom 0.254: D35L1.JJ 207.65,20.32 206.38,19.05 197.49,19.05 196.22,20.32 D35L2.JJ 194.94,20.32 193.68,21.59 181.61,21.59 178.44,24.77 E12.3
BMB10
  Top 0.254: 179.07,22.86 179.07,15.24 180.34,13.97 E11.2 | 179.07,22.86 180.34,24.13 E12.2 | 179.07,22.86 179.07,35.56 180.34,36.83 E13.2
  Bottom 0.254: D35L1.NN 207.65,15.24 206.38,13.97 197.49,13.97 196.22,15.24 D35L2.NN 194.94,15.24 193.68,13.97 184.15,13.97 183.51,14.61 182.25,14.61 180.97,13.34 E11.2
BMB11
  Top 0.254: 181.61,22.86 181.61,15.24 182.88,13.97 E11.1 | 181.61,22.86 182.88,24.13 E12.1 | 181.61,22.86 181.61,35.56 182.88,36.83 E13.1
  Bottom 0.254: D35L1.TT 207.65,10.16 206.38,8.89 197.49,8.89 196.22,10.16 D35L2.TT 194.94,10.16 193.68,11.43 187.32,11.43 186.06,12.7 183.51,12.7 E11.1
BTS1  (via drill 0.61)
  Top 0.254: v161.93,80.64 161.29,80.01 161.29,36.83 161.93,36.2 161.93,19.68 160.66,18.41 LASTDEV.3
  Bottom 0.254: LASTDEV.3 158.75,17.78 156.21,15.24 151.76,15.24 D36L1.NN 150.5,15.24 149.22,13.97 141.6,13.97 140.34,15.24 D36L2.NN | v161.93,80.64 165.74,80.64 167,79.38 E16.10
BTS3
  Bottom 0.254: LASTDEV.4 158.75,20.32 151.76,20.32 D36L1.JJ 150.5,20.32 149.22,19.05 141.6,19.05 140.34,20.32 D36L2.JJ
BUF_DN
  Top 0.254: E15.13 177.8,66.04 177.8,71.12 E15.2 178.44,71.75 179.71,71.75 E15.1
  Bottom 0.254: E4.15 231.78,46.35 236.22,50.8 236.85,50.8 238.12,52.07 238.12,74.93 182.88,74.93 180.97,73.03 E15.1
CLK_BUF  (via drill 0.61)
  Top 0.254: v223.52,57.15 222.25,58.42 222.25,68.58 220.98,69.85 E5.6 | 110.49,30.48 110.49,20.32 111.76,19.05 E21.10 112.39,17.14 v116.84,12.7 | 110.49,30.48 111.76,31.75 E22.10 | 110.49,30.48 110.49,45.72 111.76,46.99 E23.10
  Bottom 0.254: v223.52,57.15 227.33,57.15 230.5,53.98 E4.2 231.14,52.07 231.14,47.62 230.5,47.62 229.87,46.99 229.87,40.64 234.31,40.64 236.22,38.73 236.22,8.89 235.59,8.89 227.97,1.27 128.27,1.27 v116.84,12.7
DONE_FF
  Bottom 0.254: E16.11 170.81,79.38 172.72,81.28 198.12,81.28 200.03,79.38 IC10.6
DONE_SKIP  (via drill 0.61)
  Top 0.254: v111.76,90.81 111.76,92.71 E26.9 | 140.97,100.33 141.6,100.97 E20.5 | v131.44,90.81 140.97,100.33 | 140.97,100.33 140.97,66.04 142.24,64.77 E18.10
  Bottom 0.254: v111.76,90.81 112.39,91.44 130.81,91.44 v131.44,90.81
ERR_SKIP  (via drill 0.61)
  Top 0.254: v111.76,105.41 111.76,102.87 E26.6 | 143.51,102.87 144.15,102.23 E20.4 | v141.6,104.78 143.51,102.87 | 143.51,102.87 143.51,73.66 144.78,72.39 E18.4
  Bottom 0.254: v111.76,105.41 112.39,106.05 122.56,106.05 123.83,104.78 v141.6,104.78
ERROR  (via drill 0.61)
  Top 0.254: v69.85,57.78 74.93,62.87 74.93,70.48 81.28,76.83 v81.28,102.23 | v152.4,111.12 156.84,106.68 v156.84,80.64
  Bottom 0.254: v69.85,57.78 50.16,57.78 48.9,56.52 E36.1 | v81.28,102.23 84.45,105.41 110.49,105.41 116.2,111.12 v152.4,111.12 | v156.84,80.64 156.21,81.28 147.32,81.28 145.41,79.38 E19.11
GND
  Top 0.508: D34L1.UU 68.58,8.26 68.58,9.53 D34L1.SS 68.58,10.79 68.58,12.06 D34L1.PP 68.58,13.34 68.58,14.61 D34L1.MM 68.58,15.88 68.58,17.14 D34L1.KK 68.58,18.41 68.58,19.68 D34L1.HH 68.58,20.95 68.58,22.23 D34L1.EE 68.58,23.5 68.58,24.77 D34L1.CC 68.58,26.04 68.58,27.3 D34L1.AA 68.58,28.57 68.58,29.84 D34L1.Y 68.58,31.11 68.58,32.38 D34L1.W 68.58,33.66 68.58,34.92 D34L1.U 68.58,36.2 68.58,37.47 D34L1.S 68.58,38.73 68.58,40.01 D34L1.P 68.58,41.27 68.58,42.55 D34L1.M 68.58,43.81 68.58,45.09 D34L1.K 68.58,46.35 68.58,47.62 D34L1.H 68.58,48.9 68.58,50.16 D34L1.E 68.58,51.44 68.58,52.07 | 107.95,73.66 107.95,83.82 109.22,85.09 E25.7 | 107.95,73.66 109.22,72.39 E24.7 | 107.95,73.66 107.95,58.42 109.22,57.15 E23.8 | 68.58,52.07 73.66,52.07 | 73.66,52.07 74.93,52.07 78.11,55.24 IC6.4 | 68.58,52.07 68.58,52.7 D34L1.C 68.58,53.98 68.58,55.24 D34L1.A | 82.55,67.31 73.66,58.42 73.66,52.07 | 82.55,67.31 83.82,68.58 E30.7 | 82.55,67.31 82.55,83.82 83.82,85.09 E31.7 | 33.02,38.1 33.02,39.37 E35.7 | 33.02,38.1 33.02,36.2 28.57,31.75 28.57,26.67 27.94,26.04 R10.1 | 31.75,38.1 33.02,38.1 | 31.75,38.1 26.04,38.1 R13.1 | 31.75,38.1 31.75,53.34 33.02,54.61 E36.7 | SL1.3 17.14,78.11 17.14,76.83 SL1.2 | R16.1 26.04,12.7 27.3,12.7 R12.1 | DRIVE.MM 10.16,14.61 10.16,13.34 DRIVE.PP 10.16,12.06 10.16,10.79 DRIVE.SS 10.16,9.53 10.16,8.26 DRIVE.UU 10.79,7.62 12.06,7.62 DRIVE.VV 12.7,8.26 12.7,9.53 DRIVE.TT | DRIVE.NN 12.06,15.24 10.79,15.24 DRIVE.MM | DRIVE.MM 10.16,15.88 10.16,17.14 DRIVE.KK 10.16,18.41 10.16,19.68 DRIVE.HH | DRIVE.JJ 12.06,20.32 10.79,20.32 DRIVE.HH | DRIVE.HH 10.16,20.95 10.16,22.23 DRIVE.EE 10.16,23.5 10.16,24.77 DRIVE.CC 10.16,26.04 10.16,27.3 DRIVE.AA 10.16,28.57 10.16,29.84 DRIVE.Y 10.16,31.11 10.16,32.38 DRIVE.W 10.16,33.66 10.16,34.92 DRIVE.U
  Top 0.508: DRIVE.V 12.06,35.56 10.79,35.56 DRIVE.U | DRIVE.U 10.16,36.2 10.16,37.47 DRIVE.S 10.16,38.73 10.16,40.01 DRIVE.P | DRIVE.P 10.16,41.27 10.16,42.55 DRIVE.M 10.16,43.81 10.16,45.09 DRIVE.K | DRIVE.L 12.06,45.72 10.79,45.72 DRIVE.K | DRIVE.K 10.16,46.35 10.16,47.62 DRIVE.H 10.16,48.9 10.16,50.16 DRIVE.E | DRIVE.F 12.06,50.8 10.79,50.8 DRIVE.E | DRIVE.E 10.16,51.44 10.16,52.7 DRIVE.C 10.16,53.98 10.16,55.24 DRIVE.A 10.79,55.88 12.06,55.88 DRIVE.B 12.7,56.52 12.7,63.5 15.24,66.04 IC8.4 | DRIVE.R 12.06,40.64 10.79,40.64 DRIVE.P | IC9.4 60.33,76.2 56.52,76.2 C37.2 55.88,75.56 55.88,73.66 C40.- 55.88,71.12 55.88,64.14 R15.1 55.88,62.87 58.42,60.33 58.42,56.52 D34L2.A 58.42,55.24 58.42,53.98 D34L2.C 58.42,52.7 58.42,51.44 D34L2.E 58.42,50.16 58.42,48.9 D34L2.H 58.42,47.62 58.42,46.35 D34L2.K 58.42,45.09 58.42,43.81 D34L2.M 58.42,42.55 58.42,41.27 D34L2.P 58.42,40.01 58.42,38.73 D34L2.S 58.42,37.47 58.42,36.2 D34L2.U 58.42,34.92 58.42,33.66 D34L2.W 58.42,32.38 58.42,31.11 D34L2.Y 58.42,29.84 58.42,28.57 D34L2.AA 58.42,27.3 58.42,26.04 D34L2.CC 58.42,24.77 58.42,23.5 D34L2.EE 58.42,22.23 58.42,20.95 D34L2.HH 58.42,19.68 58.42,18.41 D34L2.KK 58.42,17.14 58.42,15.88 D34L2.MM 58.42,14.61 58.42,13.34 D34L2.PP 58.42,12.06 58.42,10.79 D34L2.SS 58.42,9.53 58.42,8.26 D34L2.UU | C34.2 73.66,99.69 72.39,98.42 72.39,76.83 73.66,75.56 C33.2 | C31.2 101.6,85.72 102.23,86.36 102.23,93.98 102.87,94.61 102.87,98.42 101.6,99.69 C32.2 | D36L2.UU 137.16,8.26 137.16,9.53 D36L2.SS 137.16,10.79 137.16,12.06 D36L2.PP 137.16,13.34 137.16,14.61 D36L2.MM 137.16,15.88 137.16,17.14 D36L2.KK 137.16,18.41 137.16,19.68 D36L2.HH 137.16,20.95 137.16,22.23 D36L2.EE 137.16,23.5 137.16,24.77 D36L2.CC 137.16,26.04 137.16,27.3 D36L2.AA 137.16,28.57 137.16,29.84 D36L2.Y 137.16,31.11 137.16,32.38 D36L2.W 137.16,33.66 137.16,34.92 D36L2.U 137.16,36.2 137.16,37.47 D36L2.S 137.16,38.73 137.16,40.01 D36L2.P 137.16,41.27 137.16,42.55 D36L2.M 137.16,43.81 137.16,45.09 D36L2.K 137.16,46.35 137.16,47.62 D36L2.H 137.16,48.9 137.16,50.16 D36L2.E 137.16,51.44 137.16,52.7 D36L2.C 137.16,53.98 137.16,55.24 D36L2.A 137.16,56.52 135.89,57.78 135.89,73.66
  Top 0.508: C18.2 154.94,70.48 154.94,79.38 C19.2 154.94,80.64 156.21,81.92 156.21,98.42 154.94,99.69 C20.2 | E14.8 165.1,59.69 163.83,60.96 163.83,69.85 165.1,71.12 E15.7 165.1,73.66 165.1,77.47 E16.9 165.1,80.01 165.1,85.09 E16.8 | 135.89,73.66 135.89,83.82 137.16,85.09 E19.7 | 135.89,73.66 137.16,72.39 E18.7 | 237.49,67.94 237.49,53.98 236.22,52.7 C4.2 | 237.49,67.94 236.22,69.22 C5.2 | 237.49,83.19 236.22,84.45 C6.2 | 237.49,83.19 237.49,67.94 | 237.49,83.19 237.49,98.42 236.22,99.69 C7.2 | C16.2 185.42,85.72 185.42,94.61 C17.2 | E5.7 218.44,72.39 217.17,73.66 217.17,83.82 218.44,85.09 E6.7 | 209.55,83.19 209.55,71.75 210.82,70.48 C8.2 | 209.55,83.19 210.82,84.45 C9.2 | 209.55,83.19 209.55,98.42 210.82,99.69 C10.2 | C1.2 233.68,14.61 232.41,15.88 232.41,24.13 233.68,25.4 233.68,26.04 C2.2 | D35L1.UU 205.74,8.26 205.74,9.53 D35L1.SS 205.74,10.79 205.74,12.06 D35L1.PP 205.74,13.34 205.74,14.61 D35L1.MM 205.74,15.88 205.74,17.14 D35L1.KK 205.74,18.41 205.74,19.68 D35L1.HH 205.74,20.95 205.74,22.23 D35L1.EE 205.74,23.5 205.74,24.77 D35L1.CC 205.74,26.04 205.74,27.3 D35L1.AA 205.74,28.57 205.74,29.84 D35L1.Y 205.74,31.11 205.74,32.38 D35L1.W 205.74,33.66 205.74,34.92 D35L1.U 205.74,36.2 205.74,37.47 D35L1.S 205.74,38.73 205.74,40.01 D35L1.P 205.74,41.27 205.74,42.55 D35L1.M 205.74,43.81 205.74,45.09 D35L1.K 205.74,46.35 205.74,47.62 D35L1.H 205.74,48.9 205.74,50.16 D35L1.E 205.74,51.44 205.74,52.7 D35L1.C 205.74,53.98 205.74,55.24 D35L1.A | D35L2.A 193.04,55.24 193.04,53.98 D35L2.C 193.04,52.7 193.04,51.44 D35L2.E 193.04,50.16 193.04,48.9 D35L2.H 193.04,47.62 193.04,46.35 D35L2.K 193.04,45.09 193.04,43.81 D35L2.M 193.04,42.55 193.04,41.27 D35L2.P 193.04,40.01 193.04,38.73 D35L2.S 193.04,37.47 193.04,36.2 D35L2.U 193.04,34.92 193.04,33.66 D35L2.W 193.04,32.38 193.04,31.11 D35L2.Y 193.04,29.84 193.04,28.57 D35L2.AA 193.04,27.3 193.04,26.04 D35L2.CC 193.04,24.77 193.04,23.5 D35L2.EE 193.04,22.23 193.04,20.95 D35L2.HH 193.04,19.68 193.04,18.41 D35L2.KK 193.04,17.14 193.04,15.88 D35L2.MM 193.04,14.61 193.04,13.34 D35L2.PP 193.04,12.06 193.04,10.79 D35L2.SS 193.04,9.53 193.04,8.26 D35L2.UU
  Top 0.508: C15.2 182.88,70.48 185.42,67.94 185.42,57.78 C14.2 | D36L1.UU 148.59,8.26 148.59,9.53 D36L1.SS 148.59,10.79 148.59,12.06 D36L1.PP 148.59,13.34 148.59,14.61 D36L1.MM 148.59,15.88 148.59,17.14 D36L1.KK 148.59,18.41 148.59,19.68 D36L1.HH 148.59,20.95 148.59,22.23 D36L1.EE 148.59,23.5 148.59,24.77 D36L1.CC 148.59,26.04 148.59,27.3 D36L1.AA 148.59,28.57 148.59,29.84 D36L1.Y 148.59,31.11 148.59,32.38 D36L1.W 148.59,33.66 148.59,34.92 D36L1.U 148.59,36.2 148.59,37.47 D36L1.S 148.59,38.73 148.59,40.01 D36L1.P 148.59,41.27 148.59,42.55 D36L1.M 148.59,43.81 148.59,45.09 D36L1.K 148.59,46.35 148.59,47.62 D36L1.H 148.59,48.9 148.59,50.16 D36L1.E 148.59,51.44 148.59,52.7 D36L1.C 148.59,53.98 148.59,55.24 D36L1.A | 163.83,22.86 165.1,24.13 E12.8 | 163.83,22.86 163.83,15.24 165.1,13.97 E11.8 | 163.83,22.86 163.83,35.56 165.1,36.83 E13.8 | IC10.4 198.12,85.09 193.04,80.01 193.04,72.39 E8.7
  Bottom 0.508: E21.8 108.58,24.77 102.87,24.77 102.23,24.13 C27.2 101.6,23.5 93.34,23.5 92.08,24.77 IC4.4 90.81,26.04 89.53,27.3 80.64,27.3 79.38,26.04 IC3.4 78.11,24.77 77.47,24.13 70.48,24.13 69.22,22.86 D34L1.EE | E23.8 108.58,55.24 102.87,55.24 102.23,54.61 C29.2 101.6,53.98 93.34,53.98 92.08,55.24 IC5.4 90.81,56.52 89.53,57.78 80.64,57.78 79.38,56.52 IC6.4 | C30.2 102.23,68.58 104.14,70.48 108.58,70.48 E24.7 | E22.8 108.58,40.01 102.87,40.01 102.23,39.37 C28.2 100.97,39.37 99.69,38.1 93.98,38.1 92.08,40.01 IC1.4 90.81,41.27 89.53,42.55 80.64,42.55 79.38,41.27 IC2.4 78.11,41.27 77.47,41.91 70.48,41.91 69.22,40.64 D34L1.P | SL1.2 16.51,76.2 15.24,76.2 15.24,68.58 IC8.4 15.88,66.67 17.14,65.41 26.67,65.41 27.3,66.04 C39.2 | 18.41,11.43 17.78,10.79 12.7,10.79 DRIVE.TT | 18.41,11.43 19.68,12.7 R17.1 | 18.41,11.43 23.5,11.43 24.77,12.7 R16.1 | 15.88,39.37 14.61,40.64 13.34,40.64 DRIVE.R | 15.88,39.37 17.14,38.1 R14.1 | R11.1 17.14,25.4 13.34,25.4 DRIVE.DD 12.06,25.4 10.79,25.4 DRIVE.CC | DRIVE.Z 12.06,30.48 10.79,30.48 DRIVE.Y | 15.88,39.37 23.5,39.37 24.77,38.1 R13.1 | E32.7 83.19,100.97 74.93,100.97 74.3,100.33 C34.2 73.03,100.33 72.39,99.69 53.34,99.69 | 53.34,99.69 54.61,100.97 60.33,100.97 IC7.4 | 53.34,99.69 51.44,97.79 C38.2 | C33.2 73.03,74.93 72.39,74.3 62.87,74.3 61.59,75.56 IC9.4 | D34L2.C 57.78,53.34 51.44,53.34 C36.2 50.16,53.34 35.56,53.34 33.66,55.24 E36.7 | C35.2 51.44,39.37 52.7,40.64 57.78,40.64 D34L2.P | D34L1.UU 67.94,7.62 66.67,8.89 60.33,8.89 59.05,10.16 D34L2.SS | C32.2 102.23,100.33 107.95,100.33 108.58,100.97 E26.7 109.86,100.97 111.76,99.06 124.46,99.06 125.73,100.33 126.36,100.33 C26.2 127.64,100.33 128.27,100.97 136.53,100.97 E20.7 137.79,100.97 139.7,99.06 153.03,99.06 154.31,100.33 C20.2
  Bottom 0.508: C23.2 130.18,54.61 131.44,53.34 136.53,53.34 D36L2.C | C22.2 130.18,39.37 131.44,38.1 136.53,38.1 D36L2.S | C21.2 130.18,24.13 131.44,25.4 136.53,25.4 D36L2.CC | C25.2 127.64,85.09 128.27,85.72 136.53,85.72 E19.7 | C24.2 127.64,69.85 128.27,70.48 136.53,70.48 E18.7 137.79,70.48 139.06,69.22 154.94,69.22 C18.2 | C19.2 155.57,80.01 156.21,79.38 164.47,79.38 E16.9 | C16.2 186.06,85.09 196.85,85.09 197.49,85.72 IC10.4 198.75,85.72 200.03,84.45 210.82,84.45 C9.2 211.46,85.09 217.17,85.09 217.81,85.72 E6.7 | 182.88,95.89 185.42,95.89 C17.2 | 182.88,95.89 177.16,95.89 175.9,94.61 E17.13 | 182.88,95.89 182.88,95.25 E17.16 | E10.7 193.68,100.97 195.58,99.06 208.91,99.06 210.19,100.33 C10.2 210.82,99.69 234.95,99.69 235.59,100.33 C7.2 | E2.2 229.24,27.3 230.5,26.04 233.68,26.04 C2.2 | C3.2 233.68,38.73 228.6,33.66 228.6,29.21 E2.2 | E1.7 215.26,14.61 214.63,13.97 207.65,13.97 206.38,12.7 D35L1.PP | E4.6 220.34,53.98 219.07,55.24 217.81,55.24 216.53,53.98 E4.8 215.26,52.7 214.63,52.07 207.65,52.07 206.38,53.34 D35L1.C | D35L1.CC 206.38,25.4 207.65,26.67 214.63,26.67 215.26,27.3 E2.7 216.53,28.57 217.81,29.84 226.69,29.84 227.97,28.57 E2.2 | C12.2 186.06,24.13 187.32,25.4 192.41,25.4 D35L2.CC | E8.7 192.41,71.12 183.51,71.12 C15.2 182.88,70.48 167,70.48 165.74,71.75 E15.7 | C14.2 186.06,57.15 187.32,55.88 192.41,55.88 D35L2.A | C13.2 186.06,36.83 187.32,35.56 192.41,35.56 D35L2.U | E13.5 172.09,38.73 170.81,40.01 167,40.01 165.74,38.73 E13.8 165.1,39.37 150.5,39.37 149.22,38.1 D36L1.S | E12.8 165.74,26.04 167,27.3 170.81,27.3 172.09,26.04 E12.5 | LASTDEV.1 161.29,12.7 164.47,12.7 E11.8 165.74,13.34 167,14.61 170.81,14.61 172.09,13.34 E11.5 173.35,12.06 174.62,10.79 185.42,10.79 C11.2 186.06,11.43 187.32,10.16 192.41,10.16 D35L2.SS
  Bottom 0.508: D35L1.UU 205.1,7.62 203.84,6.35 194.94,6.35 193.68,7.62 D35L2.UU | D34L1.MM 69.22,15.24 70.48,13.97 135.25,13.97 136.53,15.24 D36L2.MM
INIT  (via drill 0.61)
  Top 0.254: v149.86,66.67 149.86,66.04 147.96,64.14 E18.12 147.32,64.77 143.51,68.58 143.51,72.39 142.24,73.66 v142.24,74.93 | 168.91,68.58 170.18,69.85 170.18,71.12 E15.5 170.81,71.75 172.09,71.75 E15.4 | v167.64,67.31 168.91,68.58 | v192.41,4.45 190.5,2.54 171.45,2.54 171.45,34.29 173.99,36.83 173.99,52.07 168.91,57.15 168.91,68.58 | IC8.7 18.41,59.05 19.68,59.05 IC8.7 | 109.22,95.25 114.3,100.33 E26.5 | 109.22,95.25 E26.8 109.22,95.25 | 109.22,95.25 109.22,98.42 104.78,102.87 104.78,106.68 57.78,106.68 49.53,98.42 49.53,97.79 44.45,92.71 44.45,88.27 30.48,74.3 30.48,71.12 20.32,60.96 IC8.7 | v106.68,75.56 103.5,78.74 v103.5,93.34
  Bottom 0.254: v149.86,66.67 151.13,67.94 167,67.94 v167.64,67.31 | v192.41,4.45 212.72,4.45 215.26,6.99 E1.8 | E26.2 121.28,100.97 120.02,99.69 116.2,99.69 114.94,100.97 E26.5 | v142.24,74.93 141.6,75.56 128.27,75.56 127,74.3 116.2,74.3 114.94,75.56 v106.68,75.56 | v103.5,93.34 108.58,93.34 E26.8
LCD1
  Bottom 0.254: E31.2 97.16,85.72 98.42,85.72 E31.1 99.69,86.36 102.23,86.36 104.14,84.45 109.86,84.45 111.12,85.72 E25.6
MAINT  (via drill 0.61)
  Top 0.254: E36.6 35.56,54.61 35.56,49.53 E36.9 35.56,46.99 35.56,41.91 E35.6 35.56,39.37 35.56,34.29 E35.9 36.2,33.66 42.55,40.01 E35.3 | v222.25,106.68 222.25,88.9 223.52,87.63 E6.5 | v120.65,112.39 v113.03,104.78 | v87.63,104.14 87.63,96.52 86.36,95.25 E32.9 86.36,92.71 81.92,88.27 81.92,71.12 v76.2,65.41
  Bottom 0.254: E36.6 36.2,55.24 37.47,53.98 43.81,53.98 45.09,55.24 E36.2 46.35,56.52 48.26,58.42 66.67,58.42 73.66,65.41 v76.2,65.41 | v222.25,106.68 216.53,112.39 v120.65,112.39 | v113.03,104.78 112.39,104.14 v87.63,104.14
MSB8  (via drill 0.61)
  Top 0.254: v95.25,20.95 95.25,30.48 93.98,31.75 IC1.6 | v198.12,76.2 198.12,72.39 E8.5 | v127,75.56 125.73,74.3 125.73,58.42 124.46,57.15 E23.2 123.83,55.24 122.56,55.24 E23.3 121.92,54.61 120.65,53.34 120.65,44.45 v116.84,44.45 | v115.57,43.18 115.57,20.32 116.84,19.05 E21.12
  Bottom 0.254: v95.25,20.95 95.89,20.32 99.06,20.32 99.69,19.68 100.33,19.68 100.97,20.32 114.3,20.32 116.2,18.41 E21.12 | v198.12,76.2 127.64,76.2 v127,75.56 | v116.84,44.45 v115.57,43.18
MSB12  (via drill 0.61)
  Top 0.254: v118.11,53.98 118.11,50.8 116.84,49.53 E23.12 | v188.59,72.39 187.96,73.03 v187.96,89.53 | v138.43,90.17 129.54,81.28 v129.54,56.52
  Bottom 0.254: IC6.1 87,55.24 88.9,53.34 116.2,53.34 116.84,53.98 v118.11,53.98 128.27,53.98 128.27,55.24 v129.54,56.52 | v188.59,72.39 189.23,73.03 203.84,73.03 205.1,71.75 E8.2 | v187.96,89.53 151.13,89.53 149.86,90.81 139.06,90.81 v138.43,90.17
N$1
  Top 0.254: E14.9 165.1,49.53 165.1,46.35 76.1
N$2
  Bottom 0.254: IC1.1 99.69,41.27 104.14,45.72 119.38,45.72 121.28,47.62 E23.14
N$3  (via drill 0.61)
  Top 0.254: 83.19,11.43 83.19,17.14 IC3.7 83.82,19.05 83.82,24.13 IC3.2 83.82,26.67 82.55,27.94 82.55,38.1 83.82,39.37 IC2.2 | 83.19,11.43 83.19,6.35 57.78,6.35 57.15,6.99 57.15,20.32 45.72,31.75 E35.13 | v121.92,66.04 121.92,69.85 E24.2 | v99.06,66.04 97.79,64.77 97.79,59.05 96.52,57.78 96.52,57.15 IC5.2 96.52,54.61 96.52,49.53 IC5.7 96.52,46.99 95.25,45.72 95.25,35.56 96.52,34.29 IC1.7 96.52,31.75 96.52,26.67 IC4.2 96.52,24.13 96.52,19.05 IC4.7 95.89,17.14 95.89,11.43 83.19,11.43
  Bottom 0.254: v99.06,66.04 v121.92,66.04
N$4  (via drill 0.61)
  Top 0.254: v63.5,39.37 67.31,43.18 67.31,95.89 74.93,103.5 82.55,103.5 82.55,96.52 83.82,95.25 E32.8
  Bottom 0.254: v63.5,39.37 57.78,39.37 56.52,38.1 45.72,38.1 41.27,33.66 E35.11
N$5
  Top 0.254: E14.15 180.34,49.53 180.34,46.35 70.1
N$6
  Top 0.254: E14.14 177.8,49.53 177.8,46.35 71.1
N$7
  Top 0.254: E14.13 175.26,49.53 175.26,46.35 72.1
N$8
  Top 0.254: E14.12 172.72,49.53 172.72,46.35 73.1
N$9
  Top 0.254: E14.11 170.18,49.53 170.18,46.35 74.1
N$10
  Top 0.254: E14.10 167.64,49.53 167.64,46.35 75.1
N$11
  Top 0.254: E14.7 167.64,57.15 162.56,52.07 162.56,46.35 77.1
N$12  (via drill 0.61)
  Top 0.254: IC2.7 83.82,34.29 85.09,35.56 v85.09,43.81 85.09,45.72 83.82,46.99 IC6.7 83.82,49.53 83.82,54.61 IC6.2 | v104.78,69.22 104.78,43.81 103.5,42.55 96.52,42.55 96.52,41.91 IC1.2
  Bottom 0.254: v85.09,43.81 93.34,43.81 95.89,41.27 IC1.2 | v104.78,69.22 117.47,69.22 118.75,70.48 E24.3
N$13
  Top 0.254: E38.1 48.26,100.33 48.26,100.97 PAD10.1
N$14
  Top 0.254: E38.2 45.72,100.33 45.72,100.97 PAD11.1
N$15
  Top 0.254: E38.3 43.18,100.33 43.18,100.97 PAD12.1
N$16
  Top 0.254: E38.4 40.64,100.33 40.64,100.97 PAD13.1
N$17
  Top 0.254: E38.5 38.1,100.33 38.1,100.97 PAD14.1
N$18
  Top 0.254: E38.6 35.56,100.33 35.56,100.97 PAD15.1
N$19
  Top 0.254: E38.7 33.02,100.33 33.02,100.97 PAD16.1
N$20
  Top 0.254: E38.8 30.48,100.33 30.48,100.97 PAD17.1
N$21  (via drill 0.61)
  Top 0.254: v227.33,55.88 227.33,68.58 228.6,69.85 E5.3
  Bottom 0.254: v227.33,55.88 226.06,55.88 224.16,53.98 E4.5
N$22  (via drill 0.61)
  Top 0.254: v118.11,67.31 114.94,64.14 E24.10 | v146.05,67.31 146.05,91.44 144.78,92.71 E20.11
  Bottom 0.254: v118.11,67.31 v146.05,67.31 147.96,67.31 149.86,65.41 150.5,65.41 151.76,66.67 161.93,66.67 162.56,67.31 165.1,67.31 167,65.41 E15.9
N$23
  Top 0.254: E38.16 48.26,90.17 48.26,89.53 PAD20.1
N$24
  Top 0.254: E38.15 45.72,90.17 45.72,89.53 PAD21.1
N$25
  Top 0.254: E38.14 43.18,90.17 43.18,89.53 PAD22.1
N$26
  Top 0.254: E38.13 40.64,90.17 40.64,89.53 PAD23.1
N$27
  Top 0.254: E38.12 38.1,90.17 38.1,89.53 PAD24.1
N$28
  Top 0.254: E38.11 35.56,90.17 35.56,89.53 PAD25.1
N$29
  Top 0.254: E38.10 33.02,90.17 33.02,89.53 PAD26.1
N$30
  Top 0.254: E38.9 30.48,90.17 30.48,89.53 PAD27.1
N$31  (via drill 0.61)
  Top 0.254: v93.98,20.95 93.98,19.05 IC4.6 | v120.65,22.23 121.92,23.5 121.92,24.13 E21.3 122.56,24.77 123.83,24.77 E21.2 | v116.84,28.57 116.84,31.75 E22.12
  Bottom 0.254: v93.98,20.95 95.25,22.23 113.03,22.23 | 113.03,22.23 v120.65,22.23 | v116.84,28.57 116.2,27.94 114.3,27.94 113.03,26.67 113.03,22.23
N$32  (via drill 0.61)
  Top 0.254: v123.83,59.05 120.02,62.87 E24.12 | v166.37,60.33 165.1,61.59 165.1,63.5 E15.8
  Bottom 0.254: v123.83,59.05 124.46,58.42 162.56,58.42 164.47,60.33 v166.37,60.33
N$33
  Bottom 0.254: IC6.6 81.92,47.62 83.19,46.35 117.47,46.35 118.75,47.62 E23.13
N$34
  Top 0.254: E40.1 25.4,100.33 25.4,100.97 PAD18.1
N$35
  Bottom 0.254: E5.11 226.69,64.14 233.04,70.48 E5.1
N$36
  Top 0.254: E1.10 220.34,6.99 219.07,6.99 E1.9 218.44,8.89 218.44,13.97 E1.6
  Bottom 0.254: E2.1 231.78,27.94 234.31,27.94 235.59,26.67 235.59,10.16 223.52,10.16 221.62,8.26 E1.10
N$37  (via drill 0.61)
  Top 0.254: E8.13 205.74,64.77 203.2,67.31 203.2,69.85 E8.3 | v175.26,67.31 175.26,71.12 E15.3
  Bottom 0.254: v175.26,67.31 200.66,67.31 202.56,65.41 203.84,65.41 205.1,64.14 E8.13
N$38
  Top 0.254: E8.11 201.29,62.87 202.56,62.87 E8.12
N$39
  Top 0.254: E8.9 195.58,64.77 195.58,69.85 E8.6
N$40
  Bottom 0.254: E8.10 197.49,62.87 196.22,61.59 182.25,61.59 180.97,62.87 174.62,62.87 173.35,64.14 E15.11
N$41
  Top 0.254: E40.2 22.86,100.33 22.86,100.97 PAD19.1
N$42  (via drill 0.61)
  Top 0.254: v186.69,64.14 186.69,95.89 182.88,99.69 171.45,99.69 171.45,102.87 170.81,103.5 168.91,103.5 168.91,99.06 172.72,95.25 E17.12
  Bottom 0.254: IC7.7 66.67,93.34 67.94,92.08 160.66,92.08 161.93,93.34 164.47,93.34 E17.9 165.74,94.61 167,95.89 170.81,95.89 172.09,94.61 E17.12 | v186.69,64.14 192.41,64.14 E8.8
N$43
  Top 0.254: E40.3 20.32,100.33 20.32,100.97 PAD28.1
N$44
  Top 0.254: E24.6 111.76,72.39 110.49,73.66 110.49,87.63 109.86,88.27 104.78,88.27 104.78,99.06 102.23,101.6 99.69,101.6 E32.1
N$45
  Top 0.254: E1.11 223.52,8.89 219.71,12.7 219.71,25.4 218.44,26.67 E2.6
N$46  (via drill 0.61)
  Top 0.254: v162.56,66.04 163.19,66.67 163.19,98.42 165.1,100.33 E17.8
  Bottom 0.254: v162.56,66.04 152.4,66.04 150.5,64.14 E18.13
N$47
  Top 0.254: E25.10 114.3,80.01 115.57,81.28 115.57,90.17 116.84,91.44 116.84,92.71 E26.11
  Bottom 0.254: E26.12 118.75,93.34 117.47,93.34 E26.11
N$48
  Top 0.254: E4.10 218.44,46.99 218.44,52.07 E4.7 | E4.3 227.97,52.7 226.69,52.7 E4.4 226.06,54.61 226.06,57.78 R19.2
  Bottom 0.254: E4.7 219.07,52.7 220.34,51.44 224.16,51.44 225.43,52.7 E4.4
N$49  (via drill 0.61)
  Top 0.254: E14.5 173.35,57.78 174.62,57.78 E14.4 | v222.25,55.24 222.25,12.7 226.06,8.89 E1.12
  Bottom 0.254: v222.25,55.24 220.34,57.15 198.75,57.15 196.22,54.61 179.07,54.61 175.9,57.78 E14.4
N$50
  Top 0.254: E40.4 17.78,100.33 17.78,100.97 PAD29.1
N$51
  Top 0.254: E40.5 15.24,100.33 15.24,100.97 PAD30.1
N$52
  Top 0.254: E40.6 12.7,100.33 12.7,100.97 PAD31.1
N$53
  Top 0.254: E40.7 10.16,100.33 10.16,100.97 PAD32.1
N$54
  Top 0.254: E40.8 7.62,100.33 7.62,100.97 PAD33.1
N$55
  Top 0.254: E40.16 25.4,90.17 25.4,89.53 PAD34.1
N$56